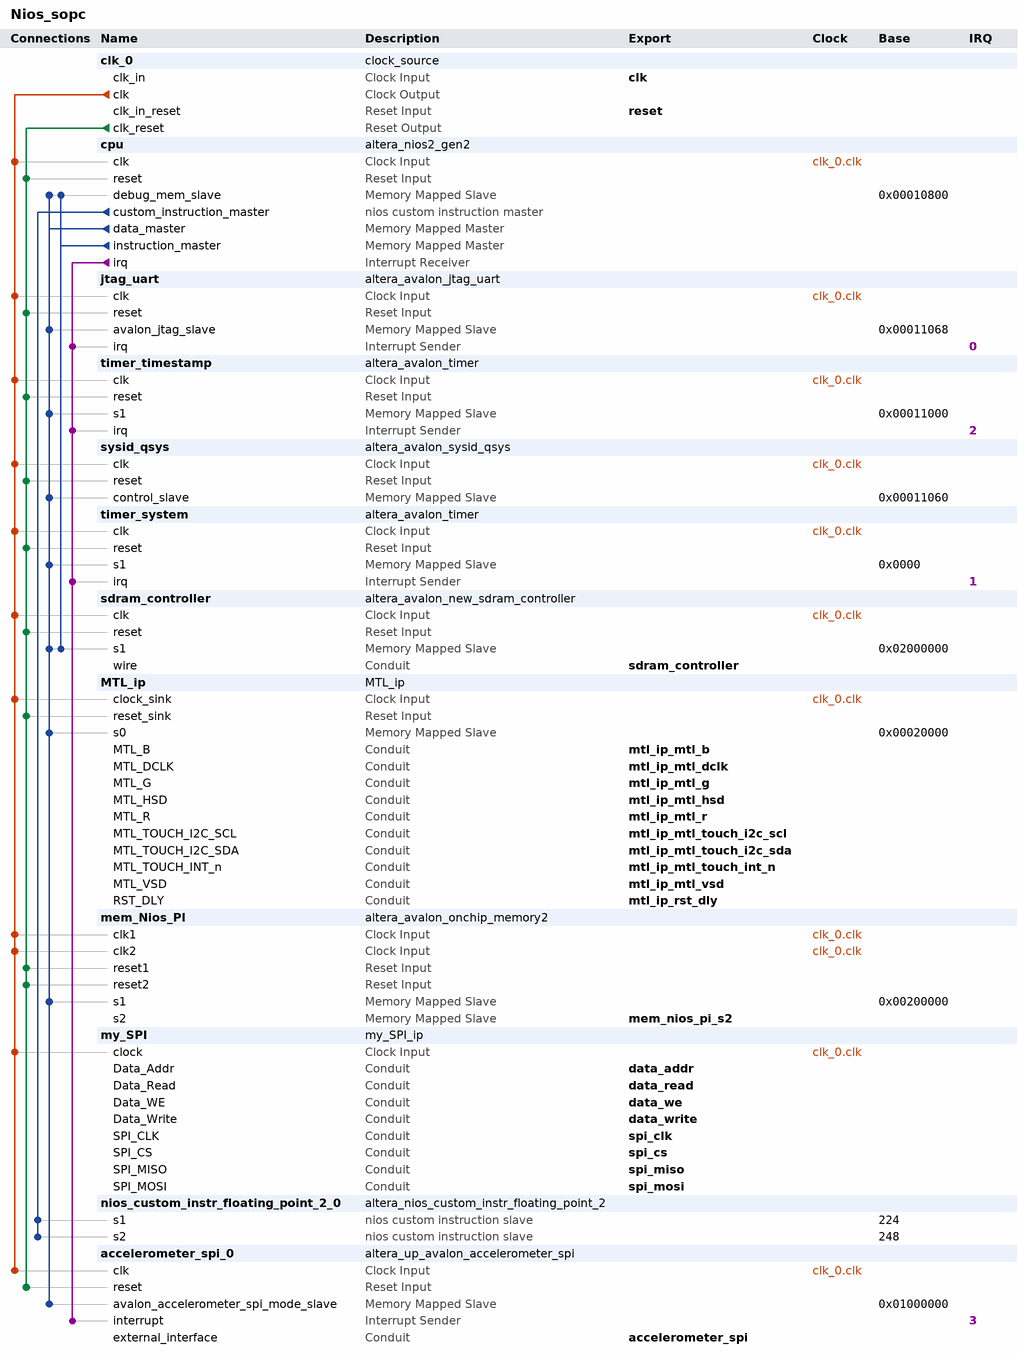
[diagram p0: system contents]
# Platform Designer (Qsys) system Nios_sopc, Cyclone IV E EP4CE22F17C6
# Parameters at their usual value, and those the tool derives, are not listed.
package require -exact qsys 16.1
create_system Nios_sopc
set_project_property DEVICE_FAMILY {Cyclone IV E}
set_project_property DEVICE EP4CE22F17C6

add_instance clk_0 clock_source 16.1
set_instance_parameter_value clk_0 clockFrequency 50000000

add_instance cpu altera_nios2_gen2 16.1
set_instance_parameter_value cpu dcache_size 2048
set_instance_parameter_value cpu exceptionSlave sdram_controller.s1
set_instance_parameter_value cpu icache_size 4096
set_instance_parameter_value cpu impl Fast
set_instance_parameter_value cpu resetSlave sdram_controller.s1

add_instance jtag_uart altera_avalon_jtag_uart 16.1
set_instance_parameter_value jtag_uart simInteractiveOptions NO_INTERACTIVE_WINDOWS

add_instance timer_timestamp altera_avalon_timer 16.1
set_instance_parameter_value timer_timestamp period 1
set_instance_parameter_value timer_timestamp periodUnits MSEC

add_instance sysid_qsys altera_avalon_sysid_qsys 16.1
set_instance_parameter_value sysid_qsys id -168430091

add_instance timer_system altera_avalon_timer 16.1
set_instance_parameter_value timer_system period 1
set_instance_parameter_value timer_system periodUnits MSEC

add_instance sdram_controller altera_avalon_new_sdram_controller 16.1
set_instance_parameter_value sdram_controller TAC 5.5
set_instance_parameter_value sdram_controller TRCD 20.0
set_instance_parameter_value sdram_controller TRP 20.0
set_instance_parameter_value sdram_controller casLatency 3
set_instance_parameter_value sdram_controller columnWidth 9
set_instance_parameter_value sdram_controller dataWidth 16
set_instance_parameter_value sdram_controller generateSimulationModel false
set_instance_parameter_value sdram_controller model single_Micron_MT48LC4M32B2_7_chip
set_instance_parameter_value sdram_controller numberOfBanks 4
set_instance_parameter_value sdram_controller numberOfChipSelects 1
set_instance_parameter_value sdram_controller powerUpDelay 100.0
set_instance_parameter_value sdram_controller refreshPeriod 15.625
set_instance_parameter_value sdram_controller rowWidth 13

add_instance MTL_ip MTL_ip 1.0

add_instance mem_Nios_PI altera_avalon_onchip_memory2 16.1
set_instance_parameter_value mem_Nios_PI dataWidth 32
set_instance_parameter_value mem_Nios_PI dualPort true
set_instance_parameter_value mem_Nios_PI initMemContent true
set_instance_parameter_value mem_Nios_PI initializationFileName onchip_mem.hex
set_instance_parameter_value mem_Nios_PI memorySize 512

add_instance my_SPI my_SPI_ip 1.0

add_instance nios_custom_instr_floating_point_2_0 altera_nios_custom_instr_floating_point_2 16.1
set_instance_parameter_value nios_custom_instr_floating_point_2_0 arithmetic_present true
set_instance_parameter_value nios_custom_instr_floating_point_2_0 comparison_present true
set_instance_parameter_value nios_custom_instr_floating_point_2_0 conversion_present true
set_instance_parameter_value nios_custom_instr_floating_point_2_0 root_present true

add_instance accelerometer_spi_0 altera_up_avalon_accelerometer_spi 16.1

# connections
add_connection clk_0.clk accelerometer_spi_0.clk clock
add_connection clk_0.clk cpu.clk clock
add_connection clk_0.clk jtag_uart.clk clock
add_connection clk_0.clk mem_Nios_PI.clk1 clock
add_connection clk_0.clk mem_Nios_PI.clk2 clock
add_connection clk_0.clk MTL_ip.clock_sink clock
add_connection clk_0.clk my_SPI.clock clock
add_connection clk_0.clk sdram_controller.clk clock
add_connection clk_0.clk sysid_qsys.clk clock
add_connection clk_0.clk timer_system.clk clock
add_connection clk_0.clk timer_timestamp.clk clock
add_connection clk_0.clk_reset accelerometer_spi_0.reset reset
add_connection clk_0.clk_reset cpu.reset reset
add_connection clk_0.clk_reset jtag_uart.reset reset
add_connection clk_0.clk_reset mem_Nios_PI.reset1 reset
add_connection clk_0.clk_reset mem_Nios_PI.reset2 reset
add_connection clk_0.clk_reset MTL_ip.reset_sink reset
add_connection clk_0.clk_reset sdram_controller.reset reset
add_connection clk_0.clk_reset sysid_qsys.reset reset
add_connection clk_0.clk_reset timer_system.reset reset
add_connection clk_0.clk_reset timer_timestamp.reset reset
add_connection cpu.data_master accelerometer_spi_0.avalon_accelerometer_spi_mode_slave avalon
set_connection_parameter_value cpu.data_master/accelerometer_spi_0.avalon_accelerometer_spi_mode_slave baseAddress 0x01000000
add_connection cpu.data_master cpu.debug_mem_slave avalon
set_connection_parameter_value cpu.data_master/cpu.debug_mem_slave baseAddress 0x00010800
add_connection cpu.data_master jtag_uart.avalon_jtag_slave avalon
set_connection_parameter_value cpu.data_master/jtag_uart.avalon_jtag_slave baseAddress 0x00011068
add_connection cpu.data_master mem_Nios_PI.s1 avalon
set_connection_parameter_value cpu.data_master/mem_Nios_PI.s1 baseAddress 0x00200000
add_connection cpu.data_master MTL_ip.s0 avalon
set_connection_parameter_value cpu.data_master/MTL_ip.s0 baseAddress 0x00020000
add_connection cpu.data_master sdram_controller.s1 avalon
set_connection_parameter_value cpu.data_master/sdram_controller.s1 baseAddress 0x02000000
add_connection cpu.data_master sysid_qsys.control_slave avalon
set_connection_parameter_value cpu.data_master/sysid_qsys.control_slave baseAddress 0x00011060
add_connection cpu.data_master timer_system.s1 avalon
set_connection_parameter_value cpu.data_master/timer_system.s1 baseAddress 0x0000
add_connection cpu.data_master timer_timestamp.s1 avalon
set_connection_parameter_value cpu.data_master/timer_timestamp.s1 baseAddress 0x00011000
add_connection cpu.instruction_master cpu.debug_mem_slave avalon
set_connection_parameter_value cpu.instruction_master/cpu.debug_mem_slave baseAddress 0x00010800
add_connection cpu.instruction_master sdram_controller.s1 avalon
set_connection_parameter_value cpu.instruction_master/sdram_controller.s1 baseAddress 0x02000000
add_connection cpu.irq accelerometer_spi_0.interrupt interrupt
set_connection_parameter_value cpu.irq/accelerometer_spi_0.interrupt irqNumber 3
add_connection cpu.irq jtag_uart.irq interrupt
set_connection_parameter_value cpu.irq/jtag_uart.irq irqNumber 0
add_connection cpu.irq timer_system.irq interrupt
set_connection_parameter_value cpu.irq/timer_system.irq irqNumber 1
add_connection cpu.irq timer_timestamp.irq interrupt
set_connection_parameter_value cpu.irq/timer_timestamp.irq irqNumber 2
add_connection cpu.custom_instruction_master nios_custom_instr_floating_point_2_0.s1 nios_custom_instruction
set_connection_parameter_value cpu.custom_instruction_master/nios_custom_instr_floating_point_2_0.s1 CIName nios_custom_instr_floating_point_2_0
set_connection_parameter_value cpu.custom_instruction_master/nios_custom_instr_floating_point_2_0.s1 baseAddress 224
add_connection cpu.custom_instruction_master nios_custom_instr_floating_point_2_0.s2 nios_custom_instruction
set_connection_parameter_value cpu.custom_instruction_master/nios_custom_instr_floating_point_2_0.s2 CIName nios_custom_instr_floating_point_2_0_1
set_connection_parameter_value cpu.custom_instruction_master/nios_custom_instr_floating_point_2_0.s2 baseAddress 248

# exported interfaces
add_interface accelerometer_spi conduit end
set_interface_property accelerometer_spi EXPORT_OF accelerometer_spi_0.external_interface
add_interface clk clock sink
set_interface_property clk EXPORT_OF clk_0.clk_in
add_interface data_addr conduit end
set_interface_property data_addr EXPORT_OF my_SPI.Data_Addr
add_interface data_read conduit end
set_interface_property data_read EXPORT_OF my_SPI.Data_Read
add_interface data_we conduit end
set_interface_property data_we EXPORT_OF my_SPI.Data_WE
add_interface data_write conduit end
set_interface_property data_write EXPORT_OF my_SPI.Data_Write
add_interface mem_nios_pi_s2 avalon slave
set_interface_property mem_nios_pi_s2 EXPORT_OF mem_Nios_PI.s2
add_interface mtl_ip_mtl_b conduit end
set_interface_property mtl_ip_mtl_b EXPORT_OF MTL_ip.MTL_B
add_interface mtl_ip_mtl_dclk conduit end
set_interface_property mtl_ip_mtl_dclk EXPORT_OF MTL_ip.MTL_DCLK
add_interface mtl_ip_mtl_g conduit end
set_interface_property mtl_ip_mtl_g EXPORT_OF MTL_ip.MTL_G
add_interface mtl_ip_mtl_hsd conduit end
set_interface_property mtl_ip_mtl_hsd EXPORT_OF MTL_ip.MTL_HSD
add_interface mtl_ip_mtl_r conduit end
set_interface_property mtl_ip_mtl_r EXPORT_OF MTL_ip.MTL_R
add_interface mtl_ip_mtl_touch_i2c_scl conduit end
set_interface_property mtl_ip_mtl_touch_i2c_scl EXPORT_OF MTL_ip.MTL_TOUCH_I2C_SCL
add_interface mtl_ip_mtl_touch_i2c_sda conduit end
set_interface_property mtl_ip_mtl_touch_i2c_sda EXPORT_OF MTL_ip.MTL_TOUCH_I2C_SDA
add_interface mtl_ip_mtl_touch_int_n conduit end
set_interface_property mtl_ip_mtl_touch_int_n EXPORT_OF MTL_ip.MTL_TOUCH_INT_n
add_interface mtl_ip_mtl_vsd conduit end
set_interface_property mtl_ip_mtl_vsd EXPORT_OF MTL_ip.MTL_VSD
add_interface mtl_ip_rst_dly conduit end
set_interface_property mtl_ip_rst_dly EXPORT_OF MTL_ip.RST_DLY
add_interface reset reset sink
set_interface_property reset EXPORT_OF clk_0.clk_in_reset
add_interface sdram_controller conduit end
set_interface_property sdram_controller EXPORT_OF sdram_controller.wire
add_interface spi_clk conduit end
set_interface_property spi_clk EXPORT_OF my_SPI.SPI_CLK
add_interface spi_cs conduit end
set_interface_property spi_cs EXPORT_OF my_SPI.SPI_CS
add_interface spi_miso conduit end
set_interface_property spi_miso EXPORT_OF my_SPI.SPI_MISO
add_interface spi_mosi conduit end
set_interface_property spi_mosi EXPORT_OF my_SPI.SPI_MOSI

set_interconnect_requirement {$system} qsys_mm.clockCrossingAdapter HANDSHAKE
set_interconnect_requirement {$system} qsys_mm.enableEccProtection FALSE
set_interconnect_requirement {$system} qsys_mm.insertDefaultSlave FALSE
set_interconnect_requirement {$system} qsys_mm.maxAdditionalLatency 1

save_system Nios_sopc.qsys
